# Altium schematic sheet TSAL HV Monitoring.SchDoc
size A4
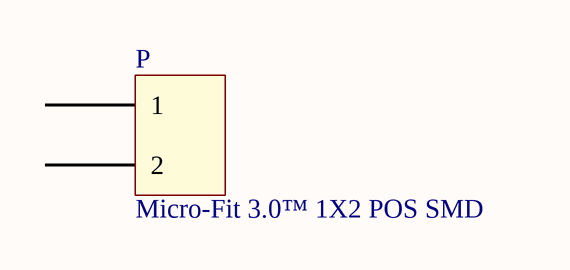
[diagram p0: TSAL HV Monitoring.SchDoc]

## Parts
P  Micro-Fit 3.0™ 1X2 POS SMD  [PCBComponent_1]

## Nets

Not connected (* = marked no-connect by the designer): P 1 2